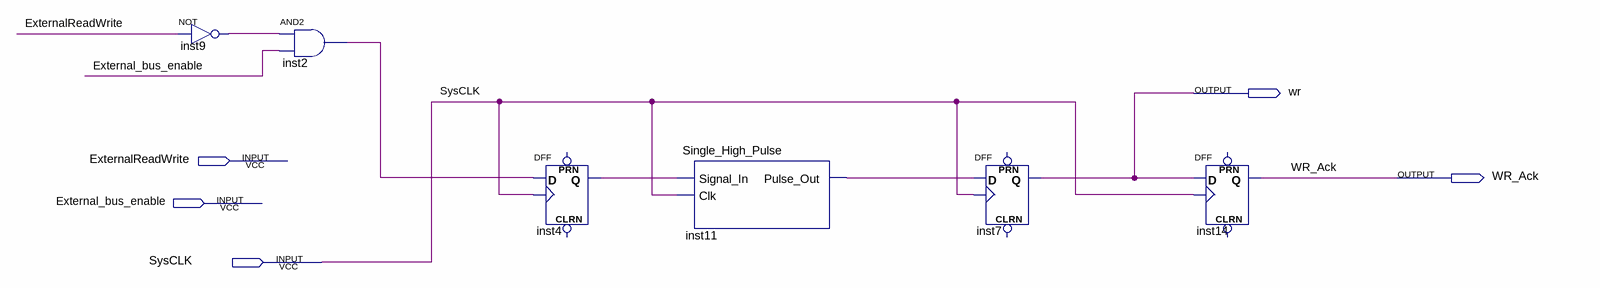
[diagram p0: schematic sheet]
// Quartus schematic CRC_RAM_Handler.bdf as structural Verilog: 6 symbols, 5 pins
module CRC_RAM_Handler (
  input  ExternalReadWrite,
  input  External_bus_enable,
  input  SysCLK,
  output wr,
  output WR_Ack
);

  wire inst2_out, inst4_q, inst9_out, inst11_pulse_out;

  not inst9 (inst9_out, ExternalReadWrite);
  and inst2 (inst2_out, inst9_out, External_bus_enable);
  DFF inst4 (.CLK(SysCLK), .D(inst2_out), .Q(inst4_q));  // open: CLRN, PRN
  Single_High_Pulse inst11 (.Signal_In(inst4_q), .Clk(SysCLK), .Pulse_Out(inst11_pulse_out));
  DFF inst7 (.CLK(SysCLK), .D(inst11_pulse_out), .Q(wr));  // open: CLRN, PRN
  DFF inst14 (.CLK(SysCLK), .D(wr), .Q(WR_Ack));  // open: CLRN, PRN
endmodule
